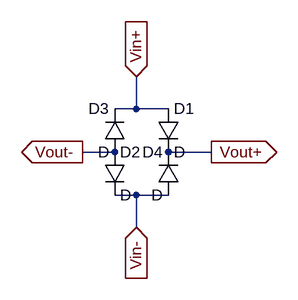
[diagram p0: schematic PuenteDeDiodos.asc]
PuenteDeDiodos.asc, the LTspice schematic file:
Version 4
SHEET 1 880 680
WIRE 160 96 160 48
WIRE 160 96 128 96
WIRE 208 96 160 96
WIRE 128 160 80 160
WIRE 272 160 208 160
WIRE 160 224 128 224
WIRE 208 224 160 224
WIRE 160 272 160 224
FLAG 160 48 Vin+
IOPIN 160 48 In
FLAG 160 272 Vin-
IOPIN 160 272 In
FLAG 80 160 Vout-
IOPIN 80 160 Out
FLAG 272 160 Vout+
IOPIN 272 160 Out
SYMBOL diode 192 96 R0
SYMATTR InstName D1
SYMBOL diode 112 160 R0
SYMATTR InstName D2
SYMBOL diode 144 160 R180
WINDOW 0 24 64 Left 2
WINDOW 3 24 0 Left 2
SYMATTR InstName D3
SYMBOL diode 224 224 R180
WINDOW 0 24 64 Left 2
WINDOW 3 24 0 Left 2
SYMATTR InstName D4

The netlist it stands for:
* PuenteDeDiodos.asc
D1 Vin+ Vout+ D
D2 Vout- Vin- D
D3 Vout- Vin+ D
D4 Vin- Vout+ D
.model D D
.lib standard.dio
.backanno
.end